# EAGLE design Quadcopter (EAGLE 9.0.1)
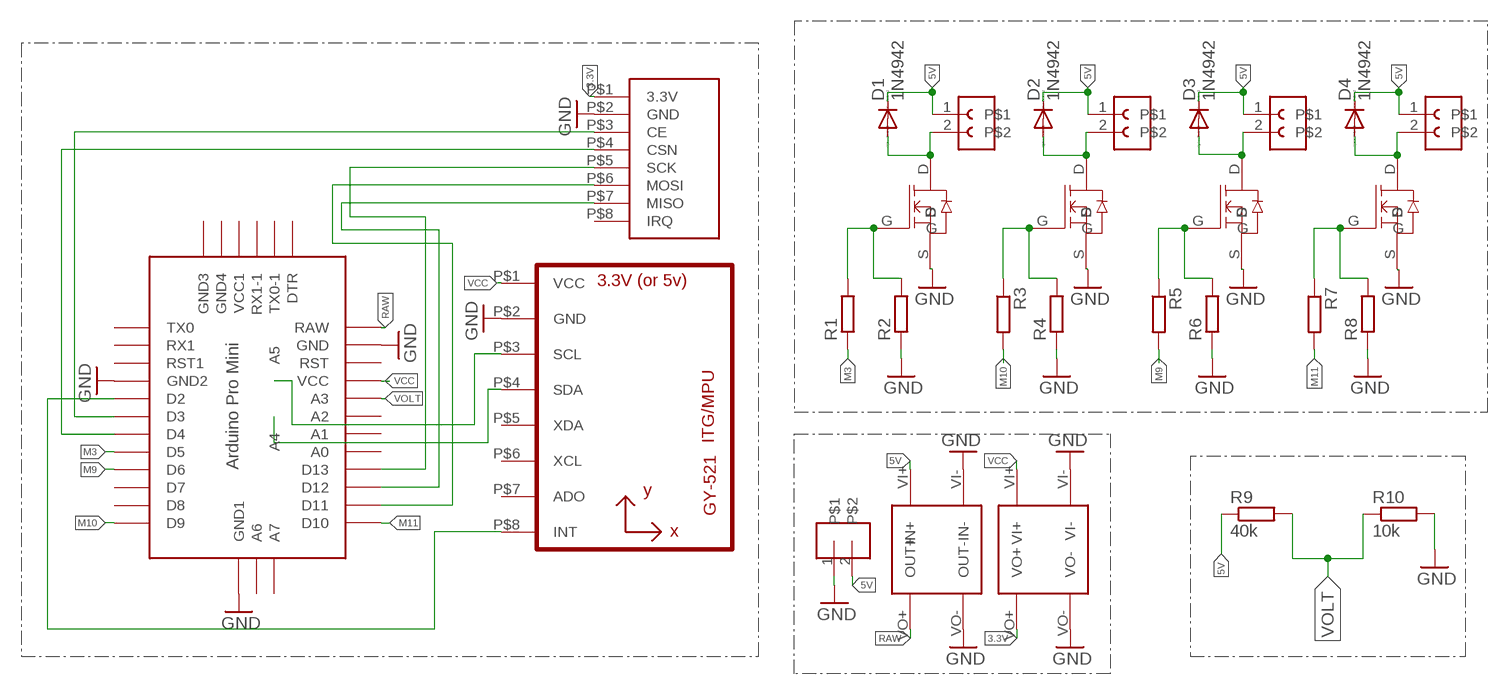
[diagram p0: schematic, sheet 1]

## Parts
D1  1N4942  [DO41-10]
D2  1N4942  [DO41-10]
D3  1N4942  [DO41-10]
D4  1N4942  [DO41-10]
R1  R-EU_R1206  [R1206]
R2  R-EU_R1206  [R1206]
R3  R-EU_R1206  [R1206]
R4  R-EU_R1206  [R1206]
R5  R-EU_R1206  [R1206]
R6  R-EU_R1206  [R1206]
R7  R-EU_R1206  [R1206]
R8  R-EU_R1206  [R1206]
R9  40k  R-EU_R1206  [R1206]
R10  10k  R-EU_R1206  [R1206]
U2  GY-521MPU6050  [GY-521]
U$1  FE02  [FE02]
U$2  FE02  [FE02]
U$3  FE02  [FE02]
U$4  ABK-PRO-MINI  [ABK-PRO-MINI]
U$5  SI2306  [SI2306]
U$6  02  [FE05-1]
U$7  SI2306  [SI2306]
U$8  SI2306  [SI2306]
U$9  FE02  [FE02]
U$10  SI2306  [SI2306]
U$11  NRF24L01  [NRF24L01]
U$12  3.3V  [3.3V]
U$13  5V  [5V]

## Nets
3.3V: U$11.P$1(3.3V) U$12.VO+
5V: D1.C D2.C D3.C D4.C R9.1 U$1.1 U$2.1 U$3.1 U$6.2 U$9.1 U$13.VI+(IN+)
GND: R2.1 R4.1 R6.1 R8.1 R10.2 U2.P$2(GND) U$4.P$10(GND2) U$4.P$20(GND) U$4.P$33(GND1) U$5.S U$6.1 U$7.S U$8.S U$10.S U$11.P$2(GND) U$12.VI- U$12.VO- U$13.VI-(IN-) U$13.VO-(OUT-)
M3: R1.1 U$4.P$14(D5)
M9: R5.2 U$4.P$15(D6)
M10: R3.2 U$4.P$18(D9)
M11: R7.2 U$4.P$30(D10)
N$1: R1.2 R2.2 U$7.G
N$2: D1.A U$3.2 U$7.D
N$3: R3.1 R4.2 U$8.G
N$4: D2.A U$1.2 U$8.D
N$5: R5.1 R6.2 U$10.G
N$6: D3.A U$9.2 U$10.D
N$7: R7.1 R8.2 U$5.G
N$8: D4.A U$2.2 U$5.D
N$12: U$4.P$12(D3) U$11.P$3(CE)
N$19: U$4.P$13(D4) U$11.P$4(CSN)
N$20: U$4.P$27(D13) U$11.P$5(SCK)
N$21: U$4.P$28(D12) U$11.P$7(MISO)
N$22: U$4.P$29(D11) U$11.P$6(MOSI)
N$23: U2.P$8(INT) U$4.P$11(D2)
N$24: U2.P$3(SCL) U$4.P$34(A5)
N$25: U2.P$4(SDA) U$4.P$35(A4)
RAW: U$4.P$19(RAW) U$13.VO+(OUT+)
VCC: U2.P$1(VCC) U$4.P$22(VCC) U$12.VI+
VOLT: R9.2 R10.1 U$4.P$23(A3)
Unconnected: U2.P$5(XDA) U2.P$6(XCL) U2.P$7(ADO) U$4.P$7(TX0) U$4.P$8(RX1) U$4.P$9(RST1) U$4.P$16(D7) U$4.P$17(D8) U$4.P$21(RST) U$4.P$24(A2) U$4.P$25(A1) U$4.P$26(A0) U$4.P$31(A7) U$4.P$32(A6) U$4.P$36(DTR) U$4.P$37(GND3) U$4.P$38(GND4) U$4.P$39(RX1-1) U$4.P$40(TX0-1) U$4.P$41(VCC1) U$11.P$8(IRQ)

## Library data of the parts
D1-D4 = diode:1N4942: DIODE 1.0 A, 200 V, 150 ns
R1-R10 = resistor:R-EU_: RESISTOR, European symbol
U2 = 複製 -gy-521:GY-521
U$1-U$3 U$9 = con-lsta:FE02
U$4 = 複製 -Arduino-clone:ABK-PRO-MINI: ABK Pro-Mini Arduino Clone
U$5 U$7 U$8 U$10 = SI2306:SI2306
U$6 = con-lsta - 複製:02
U$11 = nRF24l01:NRF24L01
U$12 = DC Trans:3.3V
U$13 = DC Trans:5V

## Board
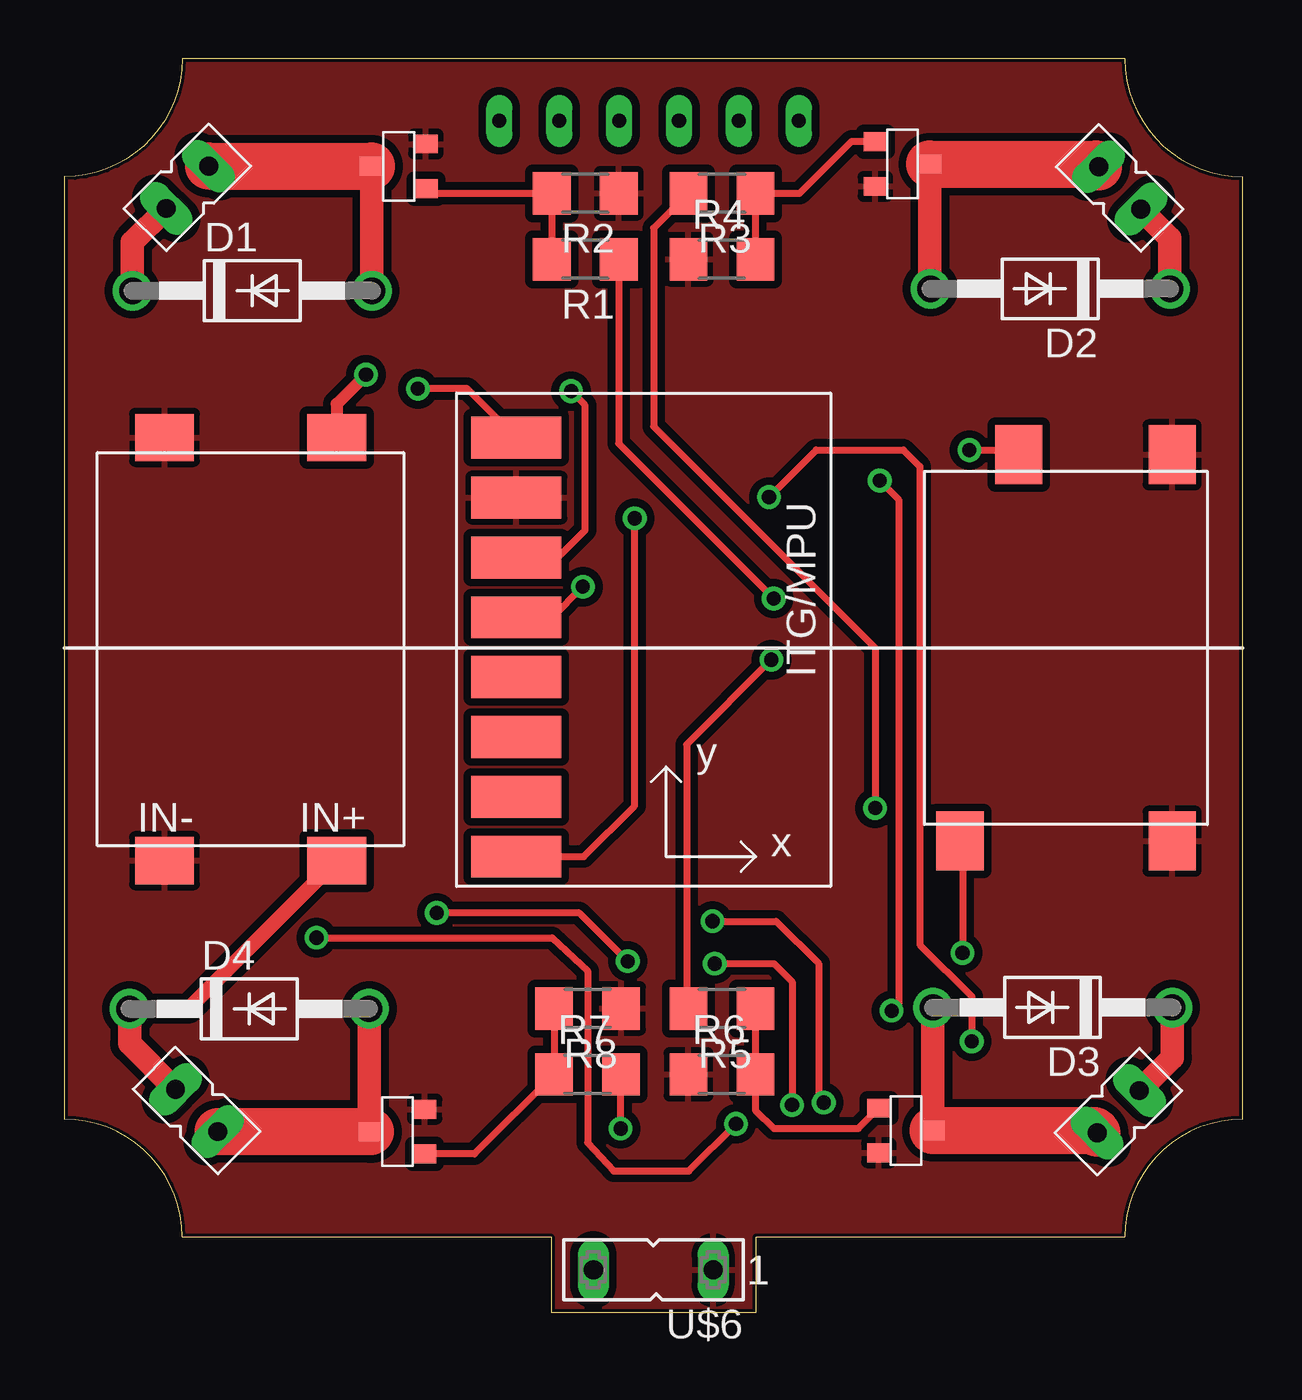
[diagram p1: board, top side]
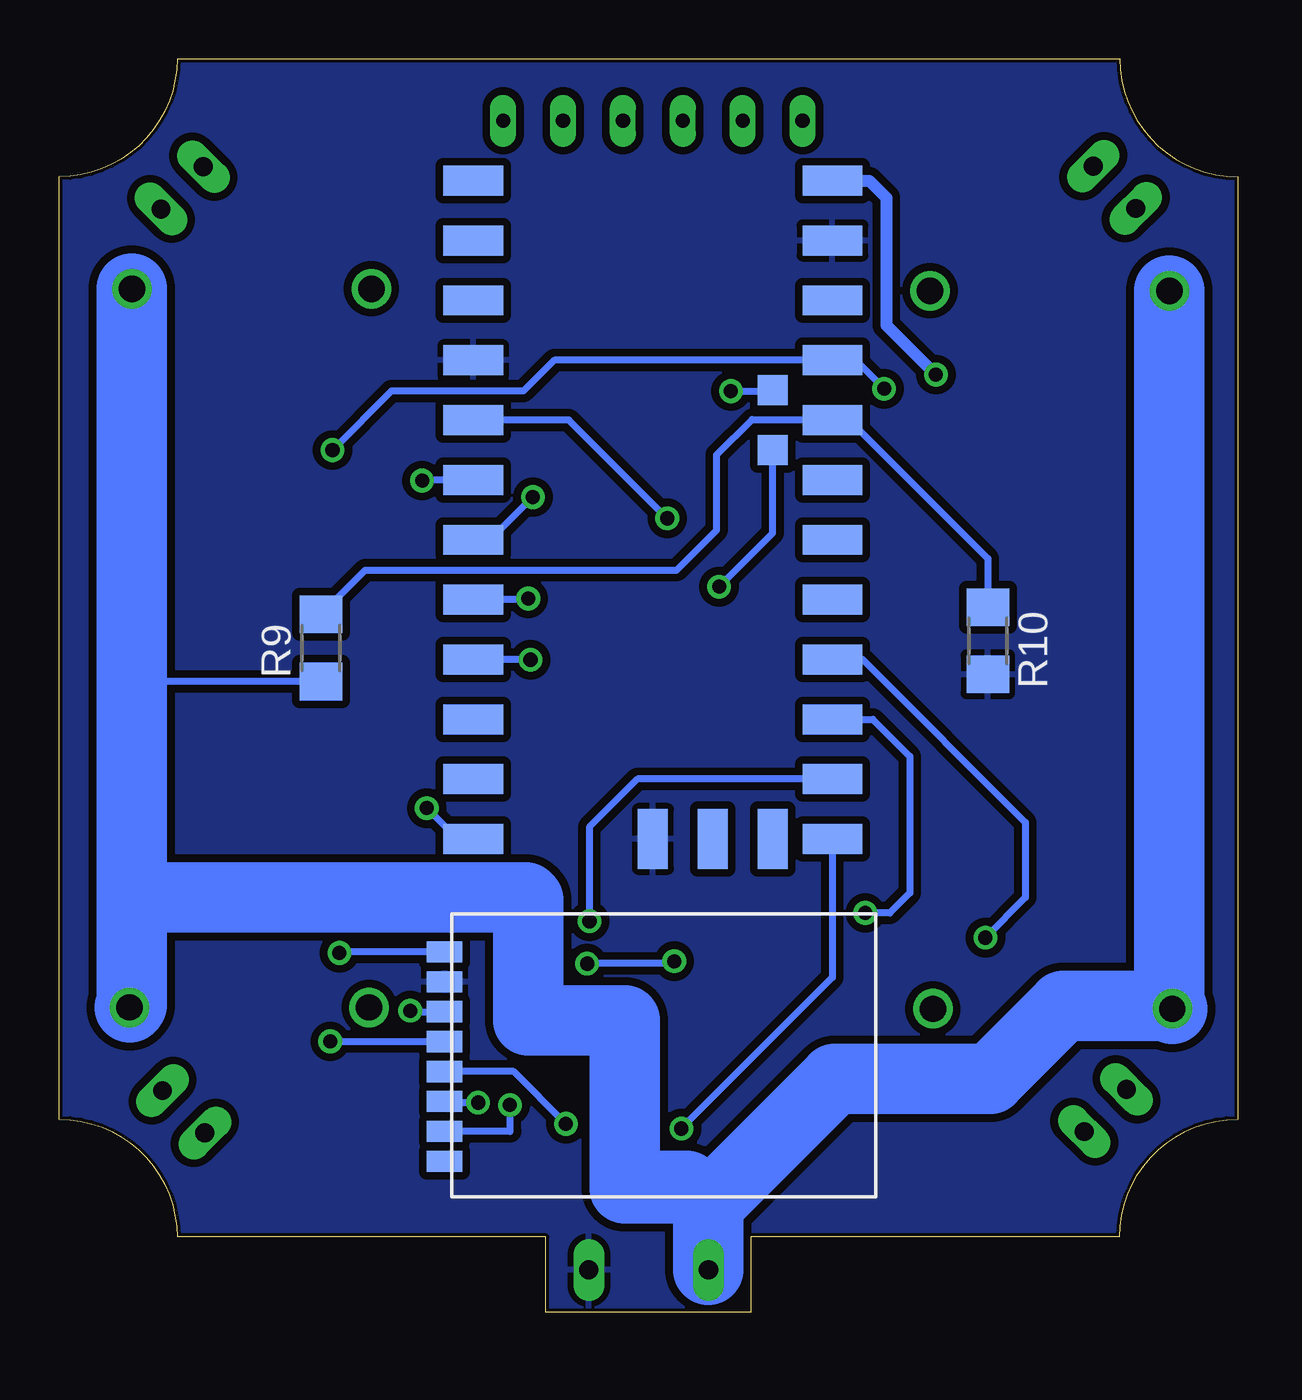
[diagram p2: board, bottom side, seen from below]

Size 50 x 53.2 mm. Coordinates in mm from the lower left corner, seen from the top.
Outline: 5,3.2 20.65,3.2 20.65,0 29.35,0 29.35,3.2 45,3.2 arc-90 50,8.2 50,48.2 arc-90 45,53.2 5,53.2 arc-90 0,48.2 0,8.2 arc-90 5,3.2
Copper layers (1*16): Top 0.035mm / dielectric 1.5mm / Bottom 0.035mm
Design rules "default *": minimum track width 6mil, minimum drill 0.35mm, track to track 13mil, track to pad 13mil, pad to pad 13mil, via to via 13mil, smd to smd 6mil, copper to edge 6mil, drill to drill 6mil, minimum pad ring 10mil, minimum via ring 8mil, stop-mask expansion 4mil, vias tented up to drill 0mil, thermal gap 10mil

### Footprints (pad centres in the part's own frame; a part is rotated, then mirrored left to right if it is on the bottom)
DO41-10 = drill 1.118: A 5.08,0; C -5.08,0
R1206 = smd 1.6 x 1.803: 1 -1.422,0; 2 1.422,0
GY-521 = smd 3.81 x 1.778: P$1 -8.89,8.89; P$2 -8.89,6.35; P$3 -8.89,3.81; P$4 -8.89,1.27; P$5 -8.89,-1.27; P$6 -8.89,-3.81; P$7 -8.89,-6.35; P$8 -8.89,-8.89
FE02 = drill 0.8 long: 1 1.27,1.27; 2 3.81,1.27
ABK-PRO-MINI = smd 2.54 x 1.27: P$7 -5.08,6.35; P$8 -5.08,3.81; P$9 -5.08,1.27; P$10 -5.08,-1.27; P$11 -5.08,-3.81; P$12 -5.08,-6.35; P$13 -5.08,-8.89; P$14 -5.08,-11.43; P$15 -5.08,-13.97; P$16 -5.08,-16.51; P$17 -5.08,-19.05; P$18 -5.08,-21.59; P$19 10.16,6.35; P$20 10.16,3.81; P$21 10.16,1.27; P$22 10.16,-1.27; P$23 10.16,-3.81; P$24 10.16,-6.35; P$25 10.16,-8.89; P$26 10.16,-11.43; P$27 10.16,-13.97; P$28 10.16,-16.51; P$29 10.16,-19.05; P$30 10.16,-21.59 | smd 1.27 x 2.54: P$31 7.62,-21.59; P$32 5.08,-21.59; P$33 2.54,-21.59 | smd 1.27 x 1.27: P$34 7.62,-2.54; P$35 7.62,-5.08 | drill 0.6 long: P$36 -3.81,8.89; P$37 -1.27,8.89; P$38 1.27,8.89; P$39 3.81,8.89; P$40 6.35,8.89; P$41 8.89,8.89
SI2306 = smd 0.8 x 1: D 1.45,1.8; G 0.5,-0.5; S 2.4,-0.5
FE05-1 = drill 0.813 long: 1 -5.08,0; 2 0,0
NRF24L01 = smd 0.9 x 1.5: P$1 1.6,-0.3; P$2 2.87,-0.3; P$3 4.14,-0.3; P$4 5.41,-0.3; P$5 6.68,-0.3; P$6 7.95,-0.3; P$7 9.22,-0.3; P$8 10.49,-0.3
3.3V = smd 2.5 x 2: VI+ 15.7,8; VI- 15.7,1.5; VO+ -0.7,10.5; VO- -0.7,1.5
5V = smd 2 x 2.5: VI+ -0.63,2.85; VI- -0.63,10.15; VO+ 17.33,2.85; VO- 17.33,10.15

### Placement (x,y rotation side)
D1  7.97,43.36 0 top
D2  41.83,43.44 180 top
D3  41.93,12.94 180 top
D4  7.85,12.88 0 top
R1  22.1,44.7 180 top
R2  22.1,47.5 180 top
R3  27.9,47.5 180 top
R4  27.9,44.7 0 top
R5  27.9,12.9 180 top
R6  27.9,10.1 0 top
R7  22.2,10.1 0 top
R8  22.2,12.9 180 top
R9  38.9,28.2 90 bottom
R10  10.6,28.5 270 bottom
U2  28.07,28.23 0 top
U$1  47.47,46.83 135 top
U$2  2.92,9.47 315 top
U$3  4.33,45.05 45 top
U$4  27.35,41.68 0 bottom
U$5  14.79,6.22 90 top
U$6  22.45,1.8 180 top
U$7  14.84,47.19 90 top
U$8  34.91,50.19 270 top
U$9  45.61,11.21 225 top
U$10  35.06,9.17 270 top
U$11  33.35,16.9 270 bottom
U$12  48.5,20.7 90 top
U$13  14.4,19.8 90 top

### Tracks (layer width: path | path; a pad name or v marks a point on that pad's centre or on a via)
3.3V  (via drill 0.6)
  Top 0.305: U$12.VO+ 38.11,19.89 v38.11,15.26
  Bottom 0.305: U$11.P$1 37.89,15.3 v38.11,15.26
5V
  Top 0.61: U$13.VI+ 5.26,12.88 D4.C
  Top 1: U$3.1 2.89,45.41 D1.C | U$1.1 46.91,45.6 D2.C | D4.C 2.77,11.41 U$2.1 | U$9.1 47.01,10.8 D3.C
  Bottom 0.305: R9.1 46.83,26.78 46.91,26.7
  Bottom 3: D1.C 2.89,13 | 2.89,13 D4.C | D2.C 46.91,26.7 46.91,17.7 | 46.91,17.7 46.91,13.04 D3.C | U$6.2 22.45,4.45 22.5,4.5 | 22.5,4.5 17.1,9.9 10.5,9.9 7.4,13 2.89,13 | 22.5,4.5 23.37,5.37 | 23.37,5.37 24.44,5.37 | 46.91,17.7 46.81,17.6 30.2,17.6 30.1,17.5 30.1,12.4 26,12.4 26,5.27 23.37,5.27 23.37,5.37
GND
  pour Top: -0.05,0 0,53.2 50,53.2 49.95,-0.05
  pour Bottom: -0.05,0 0,53.2 50,53.2 49.95,-0.05
M3  (via drill 0.6)
  Top 0.305: R1.1 23.52,36.88 v30.1,30.3
  Bottom 0.305: v30.1,30.3 30.15,30.25 U$4.P$14
M9  (via drill 0.6)
  Top 0.305: v30,27.7 26.4,24.1 26.4,12.98 R5.2
  Bottom 0.305: v30,27.7 U$4.P$15
M10  (via drill 0.6)
  Top 0.305: R3.2 25,46.02 25,37.6 34.4,28.2 v34.4,21.4
  Bottom 0.305: v34.4,21.4 33.09,20.09 U$4.P$18
M11  (via drill 0.6)
  Top 0.305: v23.6,7.8 23.6,10.08 R7.2
  Bottom 0.305: U$4.P$30 17.19,14.21 v23.6,7.8
N$1
  Top 0.305: R1.2 R2.2 15.53,47.5 U$7.G
N$2
  Top 1: U$7.D 13.04,43.47 D1.A
  Top 2: U$3.2 U$7.D
N$3
  Top 0.305: R4.2 R3.1 31.2,47.5 33.4,49.7 U$8.G
N$4
  Top 1: U$8.D 36.71,43.48 D2.A
  Top 2: U$8.D 43.77,48.74 U$1.2
N$5
  Top 0.305: R5.1 R6.2 29.32,8.58 30.1,7.8 33.69,7.8 U$10.G
N$6
  Top 1: D3.A U$10.D
  Top 2: U$10.D 43.71,7.72 U$9.2
N$7
  Top 0.305: U$5.G 17.4,6.72 R7.1 R8.2
N$8
  Top 1: D4.A 12.93,7.73 U$5.D
  Top 2: U$2.2 U$5.D
N$12  (via drill 0.6)
  Top 0.305: v34.6,35.3 35.4,34.5 35.4,13.1 v35.1,12.8
  Bottom 0.305: U$4.P$12 34.57,35.33 v34.6,35.3 | v35.1,12.8 35.06,12.76 U$11.P$3
N$19  (via drill 0.6)
  Top 0.305: v29.9,34.6 31.9,36.6 35.6,36.6 36.3,35.9 36.3,15.6 38.5,13.4 v38.5,11.5
  Bottom 0.305: U$4.P$13 31.71,32.79 v29.9,34.6 | v38.5,11.5 U$11.P$4
N$20  (via drill 0.6)
  Top 0.305: v10.7,15.9 20.7,15.9 22.2,14.5 22.2,7.2 23.3,6 26.5,6 v28.5,8
  Bottom 0.305: v10.7,15.9 9,17.6 9,20.8 15.91,27.71 U$4.P$27 | v28.5,8 30.72,10.22 U$11.P$5
N$21  (via drill 0.6)
  Top 0.305: v15.8,16.95 21.85,16.95 v23.9,14.9 | v27.6,14.8 30.1,14.8 30.88,14.03 v30.88,8.8
  Bottom 0.305: U$4.P$28 15.47,25.17 13.9,23.6 13.9,17.8 14.75,16.95 v15.8,16.95 | v23.9,14.9 24,14.8 v27.6,14.8 | v30.88,8.8 30.88,7.72 30.87,7.68 U$11.P$7
N$22  (via drill 0.6)
  Top 0.305: v27.5,16.6 30.2,16.6 32,14.8 32,9.1 v32.23,8.9
  Bottom 0.305: U$4.P$29 25.47,22.63 27.5,20.6 v27.5,16.6 | v32.23,8.9 33.6,8.9 U$11.P$6
N$23  (via drill 0.6)
  Top 0.305: U2.P$8 22.04,19.34 24.2,21.5 v24.2,33.7
  Bottom 0.305: U$4.P$11 28.37,37.87 v24.2,33.7
N$24  (via drill 0.6)
  Top 0.305: U2.P$3 20.94,32.04 22.1,33.2 22.1,38.5 v21.5,39.1
  Bottom 0.305: v21.5,39.1 19.77,39.1 U$4.P$34
N$25  (via drill 0.6)
  Top 0.305: U2.P$4 20.7,29.5 v22,30.8
  Bottom 0.305: v22,30.8 19.73,33.07 U$4.P$35
RAW  (via drill 0.6)
  Top 0.508: v12.8,39.8 11.55,38.55 U$13.VO+
  Bottom 0.508: U$4.P$19 15.63,48.03 14.9,47.3 14.9,41.9 v12.8,39.8
VCC  (via drill 0.6)
  Top 0.305: v38.4,36.6 40.3,36.6 U$12.VI+ | U2.P$1 17.1,39.2 v15,39.2
  Bottom 0.305: v15,39.2 16.21,40.41 U$4.P$22 28.99,40.41 30.3,39.1 35.9,39.1 v38.4,36.6
VOLT
  Bottom 0.305: R10.1 10.6,32 16.47,37.87 U$4.P$23 17.22,37.9 20.6,37.9 22.1,36.4 22.1,33.2 23.8,31.5 37.02,31.5 R9.2